# Altium schematic sheet MCU.SchDoc
size A4; SheetNumber: 1; SheetTotal: 4
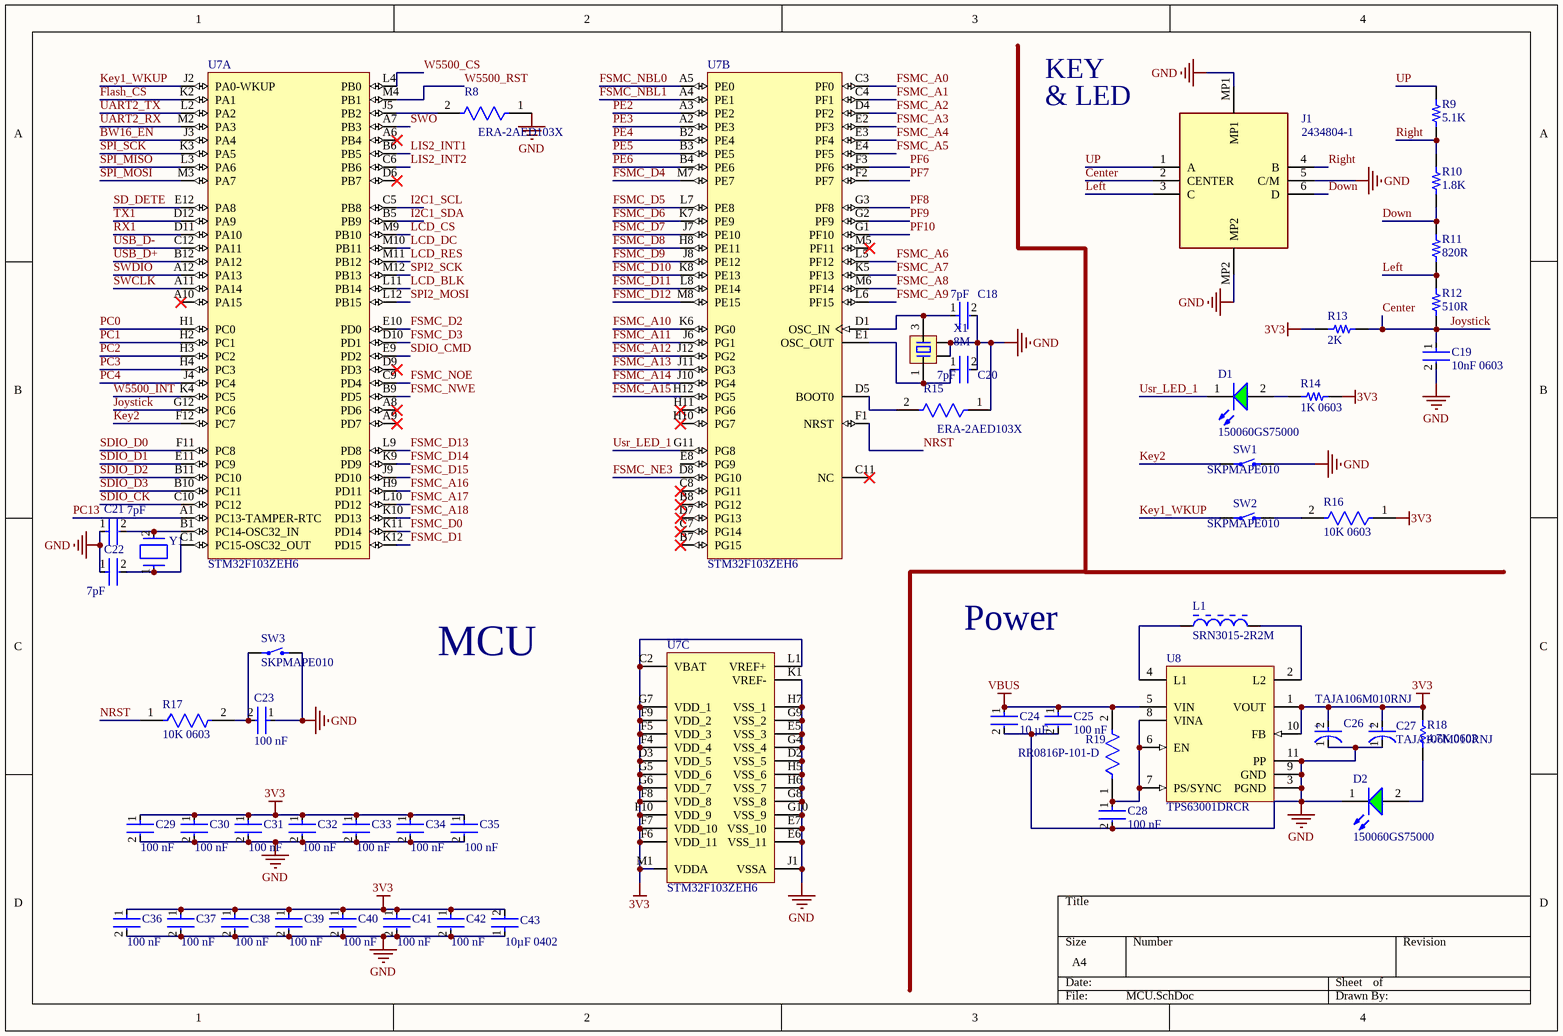
[diagram p0: MCU.SchDoc]

## Parts
C18  7pF  [FP-GJM155-0_05-IPC_B]
C19  10nF 0603  [FP-CC0603-DA-MFG]
C20  7pF  [FP-GJM155-0_05-IPC_B]
C21  7pF  [FP-GJM155-0_05-IPC_B]
C22  7pF  [FP-GJM155-0_05-IPC_B]
C23  100 nF  [FP-CL10-IPC_A]
C24  10 µF  [FP-CL10-IPC_C]
C25  100 nF  [FP-CL10-IPC_A]
C26  TAJA106M010RNJ  [FP-TAJA-MFG]
C27  TAJA106M010RNJ  [FP-TAJA-MFG]
C28  100 nF  [FP-CL10-IPC_A]
C29  100 nF  [FP-C1005-050-0_05-MFG]
C30  100 nF  [FP-C1005-050-0_05-MFG]
C31  100 nF  [FP-C1005-050-0_05-MFG]
C32  100 nF  [FP-C1005-050-0_05-MFG]
C33  100 nF  [FP-C1005-050-0_05-MFG]
C34  100 nF  [FP-C1005-050-0_05-MFG]
C35  100 nF  [FP-C1005-050-0_05-MFG]
C36  100 nF  [FP-C1005-050-0_05-MFG]
C37  100 nF  [FP-C1005-050-0_05-MFG]
C38  100 nF  [FP-C1005-050-0_05-MFG]
C39  100 nF  [FP-C1005-050-0_05-MFG]
C40  100 nF  [FP-C1005-050-0_05-MFG]
C41  100 nF  [FP-C1005-050-0_05-MFG]
C42  100 nF  [FP-C1005-050-0_05-MFG]
C43  10µF 0402  [FP-CL05A106MP5NUNC-MFG]
D1  150060GS75000  [WL-SMCW_0603_150060xx75000]
D2  150060GS75000  [WL-SMCW_0603_150060xx75000]
J1  2434804-1  [24348041]
L1  SRN3015-2R2M  [BOUR-SRN3015-2_V]
R8  ERA-2AED103X  [FP-ERA2A-IPC_B]
R9  5.1K  [5.1K_0603]
R10  1.8K  [5.1K_0603]
R11  820R  [5.1K_0603]
R12  510R  [5.1K_0603]
R13  2K  [5.1K_0603]
R14  1K 0603  [4.7R]
R15  ERA-2AED103X  [FP-ERA2A-IPC_B]
R16  10K 0603  [FP-RC0603-0_55-IPC_C]
R17  10K 0603  [FP-RC0603-0_55-IPC_C]
R18  4.7K 0603  [RESC1608X55X25LL10T15]
R19  RR0816P-101-D  [FP-RR0816-MFG]
SW1  SKPMAPE010  [KEY-SMD_2P-L6.0-W6.0-P6.00]
SW2  SKPMAPE010  [KEY-SMD_2P-L6.0-W6.0-P6.00]
SW3  SKPMAPE010  [KEY-SMD_2P-L6.0-W6.0-P6.00]
U7  STM32F103ZEH6  [STM-LFBGA144]  (parts A,B,C of 3)
U8  TPS63001DRCR  [DRC0010J_V]
X1  8M  [OSC 3225-4P]
Y1  ABS07-120-32.768KHZ-T  [FP-ABS07-120-MFG]  (value not drawn)

## Nets
3V3: C26.2(A) C27.2(A) C29.1 C30.1 C31.1 C32.1 C33.1 C34.1 C35.1 C36.1 C37.1 C38.1 C39.1 C40.1 C41.1 C42.1 C43.2 R13.2 R14.2 R16.1 R18.2 U7.C2(VBAT) U7.D3(VDD_5) U7.F4(VDD_4) U7.F5(VDD_3) U7.F6(VDD_11) U7.F7(VDD_10) U7.F8(VDD_8) U7.F9(VDD_2) U7.F10(VDD_9) U7.G5(VDD_6) U7.G6(VDD_7) U7.G7(VDD_1) U7.L1(VREF+) U7.M1(VDDA) U8.1(VOUT) U8.10(FB)
GND: C18.2 C19.2 C20.2 C21.1 C22.1 C23.1 C24.2 C25.2 C26.1(C) C27.1(C) C28.2 C29.2 C30.2 C31.2 C32.2 C33.2 C34.2 C35.2 C36.2 C37.2 C38.2 C39.2 C40.2 C41.2 C42.2 C43.1 D2.1(K) J1.5(C/M) J1.MP1 J1.MP2 R8.1 R15.1 SW1.2 SW3.2 U7.D2(VSS_5) U7.E5(VSS_3) U7.E6(VSS_11) U7.E7(VSS_10) U7.G4(VSS_4) U7.G8(VSS_8) U7.G9(VSS_2) U7.G10(VSS_9) U7.H5(VSS_6) U7.H6(VSS_7) U7.H7(VSS_1) U7.J1(VSSA) U7.K1(VREF-) U8.3(PGND) U8.9(GND) U8.11(PP) X1.2 X1.4
VBUS: C24.1 C25.1 R19.2 U8.5(VIN)
BW16_EN: U7.J3(PA4)
Center: C19.1 J1.2(CENTER) R12.1 R13.1 U7.G12(PC6)  [also labelled Joystick]
Down: J1.6(D) R10.1 R11.2
Flash_CS: U7.K2(PA1)
FSMC_A0: U7.C3(PF0)
FSMC_A1: U7.C4(PF1)
FSMC_A2: U7.D4(PF2)
FSMC_A3: U7.E2(PF3)
FSMC_A4: U7.E3(PF4)
FSMC_A5: U7.E4(PF5)
FSMC_A6: U7.L5(PF12)
FSMC_A7: U7.K5(PF13)
FSMC_A8: U7.M6(PF14)
FSMC_A9: U7.L6(PF15)
FSMC_A10: U7.K6(PG0)
FSMC_A11: U7.J6(PG1)
FSMC_A12: U7.J12(PG2)
FSMC_A13: U7.J11(PG3)
FSMC_A14: U7.J10(PG4)
FSMC_A15: U7.H12(PG5)
FSMC_A16: U7.H9(PD11)
FSMC_A17: U7.L10(PD12)
FSMC_A18: U7.K10(PD13)
FSMC_D0: U7.K11(PD14)
FSMC_D1: U7.K12(PD15)
FSMC_D2: U7.E10(PD0)
FSMC_D3: U7.D10(PD1)
FSMC_D4: U7.M7(PE7)
FSMC_D5: U7.L7(PE8)
FSMC_D6: U7.K7(PE9)
FSMC_D7: U7.J7(PE10)
FSMC_D8: U7.H8(PE11)
FSMC_D9: U7.J8(PE12)
FSMC_D10: U7.K8(PE13)
FSMC_D11: U7.L8(PE14)
FSMC_D12: U7.M8(PE15)
FSMC_D13: U7.L9(PD8)
FSMC_D14: U7.K9(PD9)
FSMC_D15: U7.J9(PD10)
FSMC_NBL0: U7.A5(PE0)
FSMC_NBL1: U7.A4(PE1)
FSMC_NE3: U7.D8(PG10)
FSMC_NOE: U7.C9(PD4)
FSMC_NWE: U7.B9(PD5)
I2C1_SCL: U7.C5(PB8)
I2C1_SDA: U7.B5(PB9)
Key1_WKUP: SW2.1 U7.J2(PA0-WKUP)
Key2: SW1.1 U7.F12(PC7)
LCD_BLK: U7.L11(PB14)
LCD_CS: U7.M9(PB10)
LCD_DC: U7.M10(PB11)
LCD_RES: U7.M11(PB12)
Left: J1.3(C) R11.1 R12.2
LIS2_INT1: U7.B6(PB5)
LIS2_INT2: U7.C6(PB6)
NRST: R17.1 U7.F1(NRST)
PC0: U7.H1(PC0)
PC1: U7.H2(PC1)
PC2: U7.H3(PC2)
PC3: U7.H4(PC3)
PC4: U7.J4(PC4)
PC13: U7.A1(PC13-TAMPER-RTC)
PE2: U7.A3(PE2)
PE3: U7.A2(PE3)
PE4: U7.B2(PE4)
PE5: U7.B3(PE5)
PE6: U7.B4(PE6)
PF6: U7.F3(PF6)
PF7: U7.F2(PF7)
PF8: U7.G3(PF8)
PF9: U7.G2(PF9)
PF10: U7.G1(PF10)
Right: J1.4(B) R9.1 R10.2
RX1: U7.D11(PA10)
SD_DETE: U7.E12(PA8)
SDIO_CK: U7.C10(PC12)
SDIO_CMD: U7.E9(PD2)
SDIO_D0: U7.F11(PC8)
SDIO_D1: U7.E11(PC9)
SDIO_D2: U7.B11(PC10)
SDIO_D3: U7.B10(PC11)
SPI2_MOSI: U7.L12(PB15)
SPI2_SCK: U7.M12(PB13)
SPI_MISO: U7.L3(PA6)
SPI_MOSI: U7.M3(PA7)
SPI_SCK: U7.K3(PA5)
SWCLK: U7.A11(PA14)
SWDIO: U7.A12(PA13)
SWO: U7.A7(PB3)
TX1: U7.D12(PA9)
UART2_RX: U7.M2(PA3)
UART2_TX: U7.L2(PA2)
UP: J1.1(A) R9.2
USB_D+: U7.B12(PA12)
USB_D-: U7.C12(PA11)
Usr_LED_1: D1.1(K) U7.G11(PG8)
W5500_CS: U7.L4(PB0)
W5500_INT: U7.K4(PC5)
W5500_RST: U7.M4(PB1)
NetC18_1: C18.1 U7.D1(OSC_IN) X1.3
NetC20_1: C20.1 U7.E1(OSC_OUT) X1.1
NetC21_2: C21.2 U7.B1(PC14-OSC32_IN) Y1.2
NetC22_2: C22.2 U7.C1(PC15-OSC32_OUT) Y1.1
NetC23_2: C23.2 R17.2 SW3.1
NetC28_1: C28.1 R19.1 U8.6(EN) U8.7(PS/SYNC) U8.8(VINA)
NetD1_2: D1.2(A) R14.1
NetD2_2: D2.2(A) R18.1
NetL1_1: L1.1 U8.4(L1)
NetL1_2: L1.2 U8.2(L2)
NetR8_2: R8.2 U7.J5(PB2)
NetR15_2: R15.2 U7.D5(BOOT0)
NetR16_2: R16.2 SW2.2

Not connected (* = marked no-connect by the designer): U7 A6(PB4)* A8(PD6)* A9(PD7)* A10(PA15)* B7(PG15)* B8(PG12)* C7(PG14)* C8(PG11)* C11(NC)* D6(PB7)* D7(PG13)* D9(PD3)* E8(PG9) H10(PG7)* H11(PG6)* M5(PF11)*

## Notes on the sheet
- KEY
- & LED
- Power
- MCU
- (in symbol CMP-2000-07219-2) +

## Library data of the parts
C18 C20-C22 = CMP-2008-03877-2: Multi-Layer Ceramic Capacitor 7pF C0G  ±0.5pF 0402 Paper T/R; Voltage Rating (DC): 50V; Case/Package: 0402; Mount: Surface Mount; Max Operating Temperature: 125°C; Case Code (Imperial): 0402; Min Operating Temperature: -55°C; Width: 0.02inch; Weight: 2.3E-05oz; Termination: SMD/SMT; Package Quantity: 10000; Packaging: Tape and Reel; Thickness: 0.022inch; Dielectric: C0G; Length: 1mm; Voltage Rating: 50V; Height: 0.5mm; Capacitance: 7pF; Radiation Hardening: No; Depth: 0.5mm; Case Code (Metric): 1005
C19 = CMP-2100-03600-2: CAP CER 10000PF 50V X7R 0603; Manufacturer Part Number: CC0603KRX7R9BB103; Manufacturer: YAGEO; Tolerance: 0.1; Material: Ceramic; Temperature Coefficient: 15%; Mouser Description: Multilayer Ceramic Capacitor, CC Series, 0.01 - F, - 10%, X7R, 50 V, 0603 [1608 Metric]; Digikey Description: CAP CER 10000PF 50V X7R 0603; Height: 0.9mm; Category: Cap; Temperature Characteristic: X7R; Footprint Url: http://www.yageo.com/exep/pages/download/literatures/UPY-C_GEN_24.pdf; Lead Free: Yes; Voltage Rating: 50 V; Temperature: -55°C to +125°C; Device Class L3: Ceramic Capacitors; ComponentLink2Description: Datasheet; Voltage: 50 V; Package: CC0603-DA; Octopart: https://octopart.com/cc0603krx7r9bb103-yageo-192938; Automotive: No; Temperature Range High: +125°C; Temperature Range Low: -55°C; Value: 10 nF; RoHS: TRUE; Device Class L1: Passive Components; ComponentLink2URL: http://www.yageo.com/documents/recent/UPY-GPHC_X7R_6.3V-to-50V_18.pdf; Device Class L2: Capacitors; Capacitance: 10 nF
C23 C25 C28 = CMP-13271-004036-1: Cap Ceramic 100nF 100V X7R ±10% Pad SMD 0603 +125°C T/R; Mount: Surface Mount; Packaging: Cut Tape; Width: 0.031inch; Thickness: 0.035inch; Length: 0.063inch; Tolerance: 10%; Min Operating Temperature: -55°C; Case/Package: 0603; Voltage Rating: 100V; Max Operating Temperature: 125°C; Case Code (Metric): 1608; Capacitance: 100nF; Case Code (Imperial): 0603
C24 = CMP-13271-004224-1: Cap Ceramic 10uF 25V X5R ±20% Pad SMD 0603 +85°C T/R; Width: 0.031inch; Voltage Rating: 25V; Length: 0.063inch; Case Code (Metric): 1608; Dielectric: X5R; Termination: Wraparound; Capacitance: 10uF; Lead Free: Lead Free; Mount: Surface Mount; Package Quantity: 1; Case Code (Imperial): 0603; Thickness: 0.035inch; Packaging: Tape and Reel; Contact Plating: Tin; Min Operating Temperature: -55°C; Tolerance: 20%; Max Operating Temperature: 85°C; Case/Package: 0603
C26 C27 = CMP-2000-07219-2: 10uF 10V  ±20% 3Ω 1206  SMD Tantalum Capacitor; Polarity: Polar; ESR (Equivalent Series Resistance): 3R; Dissipation Factor: 6%; Leakage Current: 1uA; Construction: Flat; Packaging: Tape and Reel; Voltage Rating: 10V; Lead Free: Lead Free; Radiation Hardening: No; REACH SVHC: No SVHC; Termination: SMD/SMT; Case/Package: 1206; RoHS Compliant: Yes; Min Operating Temperature: -55°C; Depth: 1.6mm; Voltage Rating (DC): 10V; Series: TAJ; Capacitance: 10uF; Height: 1.6mm; Height - Seated (Max): 0.071inch; Tolerance: 20%; Package Quantity: 1; Voltage: 10V; Features: General Purpose; Max Operating Temperature: 125°C; Lead Pitch: 1.1mm; Dielectric Material: Tantalum; Width: 0.063inch; Mount: Surface Mount; Case Code (Metric): 3216; Case Code (Imperial): 1206; Length: 3.2mm; Number of Pins: 2
C29-C42 = CMP-08246-004802-1: Multilayer Ceramic Capacitors 100nF ±10% 50V X5R SMD 0402; Voltage Rating: 50V; Weight: 2.3E-05oz; Construction: Flat; Dielectric: X5R; Packaging: Tape and Reel; REACH SVHC: No SVHC; Width: 0.02inch; RoHS Compliant: Yes; Capacitance: 100nF; Depth: 0.5mm; Voltage Rating (DC): 50V; Dielectric Material: Ceramic; Height: 0.5mm; Min Operating Temperature: -55°C; Voltage: 50V; Case Code (Imperial): 0402; Tolerance: 10%; Termination: SMD/SMT; Package Quantity: 1; Radiation Hardening: No; Resistor Type: Ceramic; Case/Package: 0402; Length: 1mm; Lead Free: Lead Free; Thickness: 0.022inch; Mount: Surface Mount; Case Code (Metric): 1005; Max Operating Temperature: 85°C; Series: C
C43 = CMP-13271-000002-1: CAP CER 10UF 10V X5R 0402; Manufacturer Part Number: CL05A106MP5NUNC; Manufacturer: Samsung; Temperature Coefficient: 15%; Tolerance: 20%; Material: Ceramic; Octopart: https://octopart.com/cl05a106mp5nunc-samsung-22457395; Voltage Rating: 10V; RoHS: TRUE; Value: 10uF; Height: 0.7mm; Digikey Description: CAP CER 10UF 10V X5R 0402; Automotive: No; Package: CL05A106MP5NUNC; Device Class L1: Passive Components; Capacitance: 10uF; Temperature Range High: +85°C; ComponentLink2Description: Datasheet; Device Class L2: Capacitors; Temperature Characteristic: X5R; Temperature: -55°C to +85°C; ComponentLink2URL: http://www.samsungsem.com/kr/support/product-search/mlcc/__icsFiles/afieldfile/2019/05/10/19-CL05A106MP5NUNC.pdf; Device Class L3: Ceramic Capacitors; Category: Cap; Temperature Range Low: -55°C; Ipc Land Pattern Name: CAPC10050X50; Lead Free: Yes
D1 D2 = CMP-1426-00002-3: NexarPartId: 29687084; Color: Green; Power Dissipation: 105mW; Peak Wavelength: 515nm; Viewing Angle: 140°; Test Current: 20mA; Wavelength: 520nm; Lens Style: Clear, Rectangular; Max Junction Temperature (Tj): 95°C; Luminous Intensity: 430mcd; Output Current: 10µA; Max Reverse Voltage (DC): 5V; Forward Voltage: 3.2V; Dominant Wavelength: 525nm; Forward Current: 100mA; Mount: Surface Mount; Height: 700µm; Lead Free: Lead Free; Min Operating Temperature: -40°C; Max Operating Temperature: 85°C; Length: 1.6mm; Width: 800µm; Case/Package: 0603; Case Code (Imperial): 0603; Case Code (Metric): 1608; Packaging: Tape and Reel; Reverse Voltage: 5V; REACH SVHC: Unknown; RoHS: Compliant
J1 = 2434804-1: Tactile Switches, Extended, Top Actuator Style, NO, Stainless Steel, Silver, Low Profile, 50 mA, 12 VDC; Manufacturer_Name: TE Connectivity; Geometry.Height: 5.7mm; Manufacturer_Part_Number: 2434804-1; Mouser Part Number: 655-2434804-1; Mouser Price/Stock: https://www.mouser.co.uk/ProductDetail/TE-Connectivity-Alcoswitch/2434804-1?qs=amGC7iS6iy%2Ff1nJtCucIMQ%3D%3D; Arrow Part Number: *; Arrow Price/Stock: *; Datasheet Link: https://www.te.com/commerce/DocumentDelivery/DDEController?Action=showdoc&DocId=Customer+Drawing%7F2434804%7FA%7Fpdf%7FEnglish%7FENG_CD_2434804_A.pdf%7F2434804-1
L1 = CMP-0007-00003-1: Semi-shielded Power Inductor, 2.2 uH, +/- 20%, 1.8 A, -40 to 125 degC, 3 x 3 x 1.5 mm SMD, RoHS and Halogen Free, Tape and Reel; Manufacturer: Bourns; Isat: 1.65 A; Rated current: 1.8 A; Inductance: 2.2 uH; Inductance tolerance: +/- 20%; DCR Max: 0.072 Ohm; SRF Min: 90 MHz; Resistance to Solder Heat: +260 degC for 10 sec.; Operating Temperature: -40 to 125 degC; PartNumber: SRN3015-2R2M; Packing: Tape and Reel; ComponentLink3Description: Package Specification; ComponentLink2Description: Datasheet; RoHS: TRUE; ComponentLink3URL: http://www.bourns.com/data/global/pdfs/SRN3015.pdf; PackageDescription: 2-Pin SMD, Body 3 x 3 mm, Height 1.5 mm; ComponentLink1URL: http://www.bourns.com/; ComponentLink1Description: Manufacturer URL; DatasheetVersion: Aug-11; Mounting Technology: Surface Mount; ComponentLink2URL: http://www.bourns.com/data/global/pdfs/SRN3015.pdf; PackageReference: SRN3015
R8 R15 = CMP-2002-05836-2: RES SMD 10K OHM 0.5% 1/16W 0402; Voltage Rating: 25V; Power Rating: 63mW; Resistance: 10kR; Temperature Coefficient: 25ppm/°C; Height: 0.016inch; Military Standard: Not; Width: 0.5mm; Series: ERA-2A; Packaging: Tape and Reel; Number of Terminations: 2; REACH SVHC: No SVHC; RoHS Compliant: Yes; Mount: Surface Mount; Weight: 2.8E-05oz; Resistance Tolerance: 0.5%; Tolerance: 0.5%; Package Quantity: 10000; Min Operating Temperature: -55°C; Case Code (Metric): 1005; Resistor Type: Thin Film; Construction: Rectangular; Depth: 0.5mm; Case Code (Imperial): 0402; Max Power Dissipation: 63mW; Max Operating Temperature: 155°C; Contact Plating: Tin; Length: 1mm; Size Code: 0402; Termination: SMD/SMT; Case/Package: 0402; Voltage Rating (DC): 25V; Lead Free: Lead Free
R9-R13 = 5.1K_0603: SMT Resistor
R14 = 4.7R 0603: SMT Resistor
R16 R17 = CMP-2100-03664-2: RES 10K OHM 1% 1/10W 0603; Voltage Rating: 75V; Voltage Rating (DC): 50V; Resistance: 10kR; Power Rating: 100mW; Temperature Coefficient: 100ppm/°C; Depth: 0.8mm; Termination: SMD/SMT; Resistor Type: Thick Film; Series: RC; Construction: Rectangular; Features: Moisture Resistant; Packaging: Tape and Reel; Min Operating Temperature: -55°C; Number of Terminations: 2; Lead Pitch: 0.3mm; RoHS Compliant: Yes; Case/Package: 0603; Resistance Tolerance: 1%; Military Standard: Not; Weight: 7.1E-05oz; Number of Pins: 2; Tolerance: 1%; Length: 1.6mm; Case Code (Imperial): 0603; Lead Free: Lead Free; Width: 0.8mm; Max Power Dissipation: 100mW; Height: 0.45mm; Max Operating Temperature: 155°C; Case Code (Metric): 1608; Size Code: 0603
R18 = CMP-2000-06942-1: Chip Resistor, 4.7 KOhm, +/- 1%, 0.1 W, -55 to 155 degC, 0603 (1608 Metric), RoHS, Tape and Reel; Manufacturer: Yageo; Power Rating: 100mW; Temperature Coefficient: 100PPM/C; Resistance: 4.7kOhms; Voltage Rating: 50V; Package Reference: 0603; Series: RC; Datasheet Version: Rev. 7, 05/2017; Packaging: Reel; Termination Style: SMD/SMT; Datasheet URL: http://www.yageo.com/documents/recent/PYu-RC_Group_51_RoHS_L_7.pdf; Manufacturer URL: http://www.yageo.com/; Package Description: 2-Pin Surface Mount Device, Body 1.6 x 0.8 mm; Case Code - mm: 1608; Case Code - in: 0603; Mounting Technology: SurfaceMount; Operating Temperature Range: -55Cto+155C; Tolerance: 1%; Product: ThickFilmResistorsGeneralPurpose
R19 = CMP-2000-02416-2: 100Ω ±0.5% 0.0625W 1/16W Chip Resistor 0603 (1608 Metric) Thin Film; Voltage Rating: 75V; Power Rating: 63mW; Resistance: 100R; Temperature Coefficient: 25ppm/°C; Number of Terminations: 2; Resistance Tolerance: 0.5%; Termination: SMD/SMT; Tolerance: 0.5%; Case/Package: 0603; Series: RR; Min Operating Temperature: -55°C; Case Code (Imperial): 0603; Number of Pins: 2; Packaging: Cut Tape; Width: 0.031inch; Resistor Type: Thin Film; RoHS Compliant: Yes; Lead Free: Lead Free; Depth: 0.8mm; Technology: THIN FILM; Size Code: 0603; Voltage Rating (DC): 75V; Package Quantity: 1; Case Code (Metric): 1608; Length: 1.6mm; Height: 0.4mm; Max Operating Temperature: 125°C; Weight: 7.1E-05oz; Max Power Dissipation: 63mW
U7 = CMP-0237-00023-3: ARM Cortex-M3 32-bit MCU, 512 KB Flash, 64 KB Internal RAM, 112 I/Os, 144-pin LFBGA, -40 to 85 degC, Tray; Operating Frequency(F) (Processor speed) (MHz): 72; Internal RAM Size (kB): 64; Supply Voltage(Vcc) min (V): 2; D/A Converter: 2x12-bit (2 Channel); A/D Converter: 3x12-bit (21 Channel); FLASH Size (Prog) (kB): 512; I/Os (High Current): 112; PackageVersion: Rev. 3, 01/2012; Packing: Tray; PackageDescription: 144-Ball Low Profile Fine Pitch BGA, 10 x 10 x 1.7 mm Body, 0.8 mm Pitch; ComponentLink2URL: http://www.st.com/st-web-ui/static/active/en/resource/technical/document/datasheet/CD00191185.pdf; ComponentLink3Description: Package Specification; Core: ARM Cortex-M3; PartNumber: STM32F103ZEH6; ComponentLink1Description: Manufacturer URL; ComponentLink3URL: http://www.st.com/st-web-ui/static/active/en/resource/technical/document/datasheet/CD00253742.pdf; PackageReference: LFBGA144; ComponentLink1URL: http://www.st.com/web/en/home.html; DatasheetVersion: Rev. 8; Mounting Technology: Surface Mount; ComponentLink2Description: Datasheet
U8 = CMP-0345-00006-2: Buck-Boost Voltage Converter with 1.8 to 5.5 V Input and 3.3 V Output, -40 to 85 degC, 10-Pin SON (DRC), Green (RoHS & no Sb/Br); Manufacturer: Texas Instruments; Synchronous Rectification: TRUE; Iq(Typ)(mA): 0.03; Regulated Outputs(#): 1; Preset Vout(V): 3.3; Vin(Min)(V): 1.8; Switching Frequency(Max)(kHz): 1500; Iout(Max)(A): 1.2; SubFamily: Buck-Boost Regulator; Vin(Max)(V): 5.5; PartNumber: TPS63001DRCR; Topology: Buck-Boost; Dynamic Voltage Scaling: TRUE; PackageVersion: revL, Sep-2011; ComponentLink2Description: Package Specification; DatasheetVersion: SLVS520B; Eco-Plan: Green (RoHS & no Sb/Br); ComponentLink1URL: http://www.ti.com/general/docs/lit/getliterature.tsp?genericPartNumber=TPS63001&fileType=pdf; Mounting Technology: Surface Mount; Vout(Min)(V): 3.3; ComponentLink2URL: http://www.ti.com/litv/pdf/mpds117k; PackageDescription: 10-Pin Plastic Small Outline No-Lead, 3 x 3 x 1 mm Body, 0.5 mm Pitch, Exposed Pad; PackageReference: DRC0010J; Vout(Max)(V): 3.3; ComponentLink1Description: Datasheet
X1 = XTAL-4P: BOM名称: 4脚无源晶振; 版权归属: 源创客; 学习资源: www.ooocke.com
Y1 = CMP-2000-07587-2: CRYSTAL 32.7680KHZ 6PF SMD; Frequency Tolerance: 20ppm; Series Resistance: 60kR; ESR (Equivalent Series Resistance): 55kR; Depth: 1.5mm; Width: 0.061inch; Number of Pins: 2; Max Operating Temperature: 85°C; Length: 3.2mm; Case/Package: SMD/SMT; Series: ABS07; Lead Free: Lead Free; Min Operating Temperature: -40°C; Load Capacitance: 6pF; Packaging: Tape and Reel; Height: 0.035inch; Radiation Hardening: No; Tolerance: 20ppm; Operating Frequency: 32.768 kHz; Termination: SMD/SMT; REACH SVHC: No SVHC; RoHS Compliant: Yes; Frequency: 32.768kHz; Package Quantity: 3000; Mount: Surface Mount